# Altium schematic sheet LED点阵时钟.SchDoc
size A2
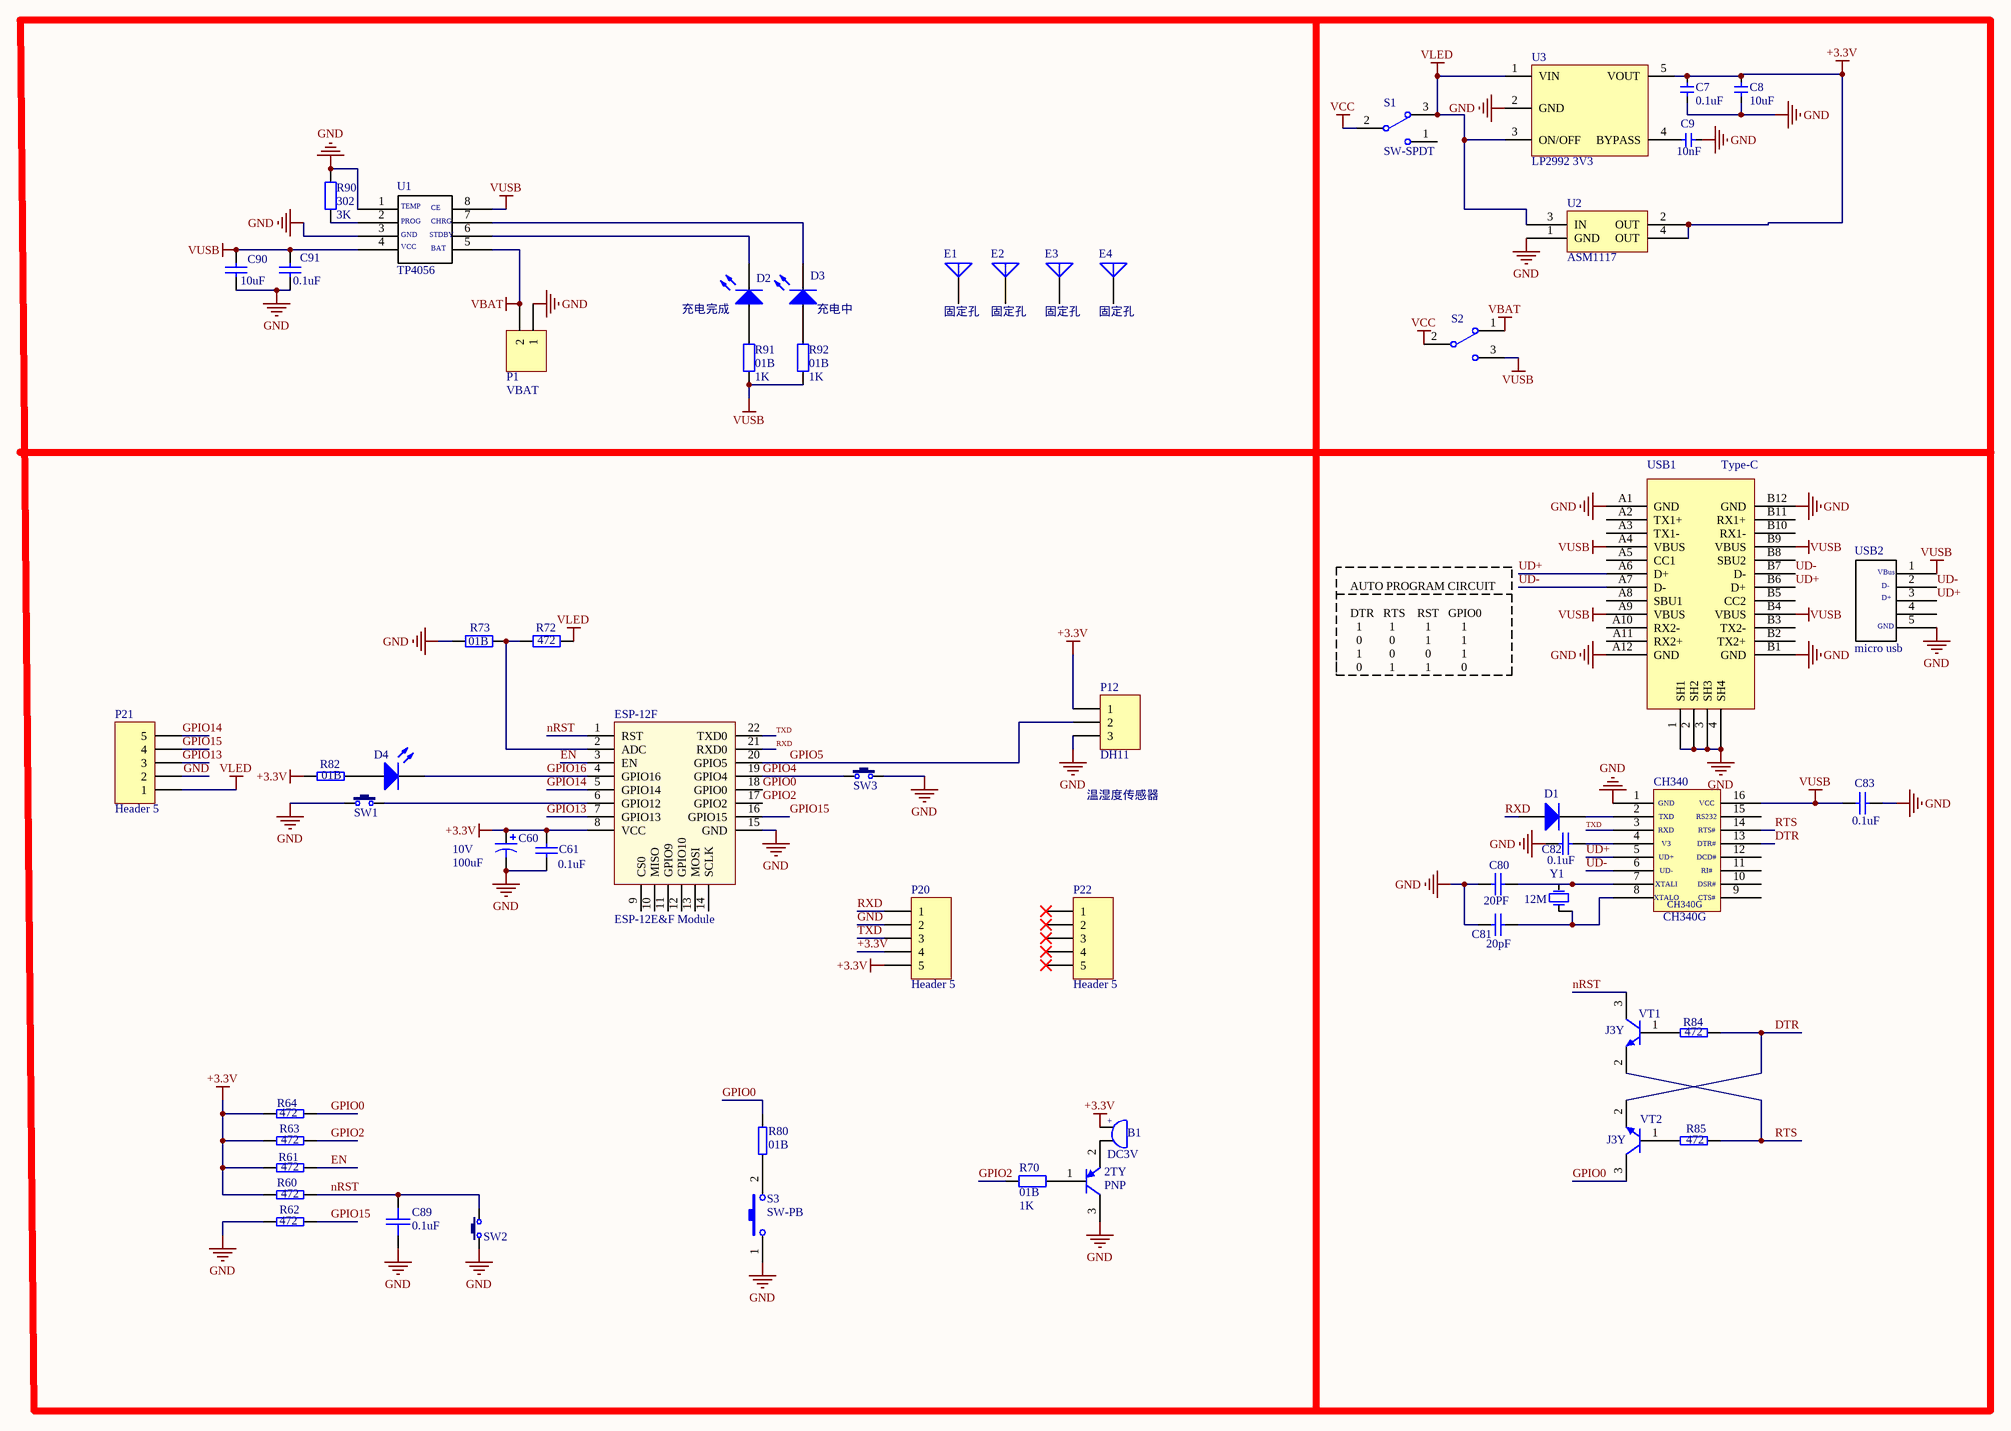
[diagram p0: LED点阵时钟.SchDoc]

## Parts
2TY  PNP  [2TY]
B1  DC3V  [BEEP 7.6x12x7.5 - X]
C7  0.1uF  [0603-1]
C8  10uF  [0603-1]
C9  10nF  [0603-1]
C60  10V  value 100uF  [CM C(5*5.4)]
C61  value 0.1uF  [0603-1]
C80  20PF  [0603-1]
C81  (no value)  [0603-1]
C82  value 0.1uF  [0603-1]
C83  value 0.1uF  [0603-1]
C89  0.1uF  [0603-1]
C90  value 10uF  [0603-1]
C91  value 0.1uF  [0603-1]
CH340  CH340G  [SOP16_M]
D1  (no value)  [T4 -Mini]
D2  (no value)  [LED 0603G]
D3  (no value)  [LED 0603R]
D4  (no value)  [LED 0603G]
E1  固定孔  [M2.2]
E2  固定孔  [M2.2]
E3  固定孔  [M2.2]
E4  固定孔  [M2.2]
ESP-12F  ESP-12E&F Module  [ESP-12E&F Module]
P1  VBAT  [XH2.54-2P_H]
P12  DH11  [HDR1X3]
P20  Header 5  [HDR1X5]
P21  Header 5  [HDR1X5]
P22  Header 5  [HDR1X5]
R60  472  [0603-1]
R61  472  [0603-1]
R62  472  [0603-1]
R63  472  [0603-1]
R64  472  [0603-1]
R70  01B  value 1K  [0603-1]
R72  472  [0603-1]
R73  01B  [0603-1]
R80  01B  [0603-1]
R82  01B  [0603-1]
R84  472  [0603-1]
R85  472  [0603-1]
R90  302  value 3K  [0603-1]
R91  01B  value 1K  [0603-1]
R92  01B  value 1K  [0603-1]
S1  SW-SPDT  [SS-12F23]
S2  (no value)  [MSK-12C01-07 - 7pin]
S3  SW-PB  [SW2 _1]
SW1  6x6x5  [TSW DIP-6*6*7_V]  (value not drawn)
SW2  6x6x5  [TSW DIP-6*6*7_V]  (value not drawn)
SW3  6x6x5  [TSW DIP-6*6*7_V]  (value not drawn)
U1  TP4056  [SOP8_N]
U2  ASM1117  [SOT-223]
U3  LP2992 3V3  [SOT23-5]
USB1  Type-C  [USB_TYPE_C_FEMALE_12_16P]
USB2  micro usb  [USB-micro_C]
VT1  J3Y  [J3Y]
VT2  J3Y  [J3Y]
Y1  value 12M  [XTAL-49S DIP]  (hidden comment: XTAL)

## Nets
+3.3V: B1.1 C7.2 C8.2 C60.1 C61.2 ESP-12F.8(VCC) P12.1 P20.4 P20.5 R60.1 R61.1 R63.1 R64.1 R82.2 U2.2(OUT) U2.4(OUT) U3.5(VOUT)
GND: 2TY.3(C) C7.1 C8.1 C9.1 C60.2 C61.1 C80.1 C81.1 C82.1 C83.2 C89.2 C90.1 C91.1 CH340.1 ESP-12F.15(GND) P1.1 P12.3 P20.2 P21.2 R62.1 R73.1 R90.1 S3.1 SW1.1 SW2.1 SW3.2 U1.1 U1.3 U2.1(GND) U3.2(GND) USB1.1(SH1) USB1.2(SH2) USB1.3(SH3) USB1.4(SH4) USB1.A1(GND) USB1.A12(GND) USB1.B1(GND) USB1.B12(GND) USB2.5
VBAT: P1.2 S2.1 U1.5
VCC: S1.2 S2.2
VLED: P21.1 R72.2 S1.3 U2.3(IN) U3.1(VIN) U3.3(ON/OFF)
VUSB: C83.1 C90.2 C91.2 CH340.16 R91.1 R92.2 S2.3 U1.4 U1.8 USB1.A4(VBUS) USB1.A9(VBUS) USB1.B4(VBUS) USB1.B9(VBUS) USB2.1
DTR: CH340.13 R84.2 VT2.2(E)
EN: ESP-12F.3(EN) R61.2
GPIO0: ESP-12F.18(GPIO0) R64.2 R80.2 VT2.3(C)
GPIO2: ESP-12F.17(GPIO2) R63.2 R70.2
GPIO4: ESP-12F.19(GPIO4) SW3.1
GPIO5: ESP-12F.20(GPIO5) P12.2
GPIO13: ESP-12F.7(GPIO13) P21.3
GPIO14: ESP-12F.5(GPIO14) P21.5
GPIO15: ESP-12F.16(GPIO15) P21.4 R62.2
GPIO16: D4.2(K) ESP-12F.4(GPIO16)
nRST: C89.1 ESP-12F.1(RST) R60.2 SW2.2 VT1.3(C)
RTS: CH340.14 R85.2 VT1.2(E)
RXD: D1.1(A) ESP-12F.21(RXD0) P20.1
TXD: CH340.3 ESP-12F.22(TXD0) P20.3
UD+: CH340.5 USB1.A6(D+) USB1.B6(D+) USB2.3
UD-: CH340.6 USB1.A7(D-) USB1.B7(D-) USB2.2
Net2TY_1: 2TY.1(B) R70.1
Net2TY_2: 2TY.2(E) B1.2
NetC9_2: C9.2 U3.4(BYPASS)
NetC80_2: C80.2 CH340.7 Y1.2(OSC2)
NetC81_2: C81.2 CH340.8 Y1.1(OSC1)
NetC82_2: C82.2 CH340.4
NetCH340_2: CH340.2 D1.2(K)
NetD2_1: D2.1(A) R91.2
NetD2_2: D2.2(K) U1.6
NetD3_1: D3.1(A) R92.1
NetD3_2: D3.2(K) U1.7
NetD4_1: D4.1(A) R82.1
NetESP-12F_2: ESP-12F.2(ADC) R72.1 R73.2
NetESP-12F_6: ESP-12F.6(GPIO12) SW1.2
NetR80_1: R80.1 S3.2
NetR84_1: R84.1 VT1.1(B)
NetR85_1: R85.1 VT2.1(B)
NetR90_2: R90.2 U1.2

Not connected (* = marked no-connect by the designer): CH340 9 10 11 12 15; E1 1(A); E2 1(A); E3 1(A); E4 1(A); ESP-12F 9(CS0) 10(MISO) 11(GPIO9) 12(GPIO10) 13(MOSI) 14(SCLK); P22 1* 2* 3* 4* 5*; S1 1; USB1 A2(TX1+) A3(TX1-) A5(CC1) A8(SBU1) A10(RX2-) A11(RX2+) B2(TX2+) B3(TX2-) B5(CC2) B8(SBU2) B10(RX1-) B11(RX1+); USB2 4

## Notes on the sheet
- 充电完成
- (near D3) 充电中
- AUTO PROGRAM CIRCUIT
  DTR   RTS    RST   GPIO0
  1         1          1          1
  0         0          1          1
  1         0          0          1
  0         1          1          0
- 温湿度传感器
- (in symbol BEEP) +
- (in symbol CH340G) GND; VCC; TXD; RS232; RXD; RTS#; V3; DTR#; UD+; DCD#; UD-; RI#; XTALI; DSR#; XTALO; CTS#
- (in symbol micro usb) VBus; D-; D+; GND
- (in symbol TP4056) TEMP; CE; PROG; CHRG; GND; STDBY; VCC; BAT

## Library data of the parts
2TY = PNP: PNP Bipolar Transistor; Published: 8-Jun-2000; LatestRevisionDate: 29-May-2009; LatestRevisionNote: IPC-7351 Footprint Added.; PackageVersion: Aug-1999; PackageReference: SOT-23B; Publisher: Altium Limited; PackageDescription: 3-Pin SOT-23 Package 0.95 mm Pitch, 2.4 mm Lead Span
B1 = BEEP: 蜂鸣器; 版权归属: 源创客; BOM名称: 蜂鸣器; 学习资源: www.ooocke.com
C7 C9 = 电容-0402: Capacitor; Value: 0.1u
C8 = 电容-0603: Capacitor; Value: 0.1u
C60 = Cap Pol3: Polarized Capacitor (Surface Mount); Published: 8-Jun-2000; LatestRevisionDate: 29-May-2009; LatestRevisionNote: IPC-7351 Footprint Added.; PackageReference: C0805; Publisher: Altium Limited; PackageDescription: Chip Capacitor
C61 C82 C83 C90 C91 = Cap: Capacitor; Published: 8-Jun-2000; LatestRevisionDate: 17-Jul-2002; LatestRevisionNote: Re-released for DXP Platform.; PackageReference: RAD-0.3; Publisher: Altium Limited; PackageDescription: Radial Cap, Thru-Hole; 2 Leads; 0.3 in Pin Spacing
C80 C81 = Cap: Published: 8-Jun-2000; LatestRevisionDate: 17-Jul-2002; LatestRevisionNote: Re-released for DXP Platform.; PackageReference: RAD-0.3; Publisher: Altium Limited; PackageDescription: Radial Cap, Thru-Hole; 2 Leads; 0.3 in Pin Spacing
  C80: Value: 20pF
C89 = SMT_C_0402: Surface mount capacitor 0402
D1 = Diode 1N4003: 1 Amp General Purpose Rectifier; Published: 8-Jun-2000; LatestRevisionDate: 17-Jul-2002; LatestRevisionNote: Re-released for DXP Platform.; DatasheetVersion: 1998; PackageVersion: Aug-1999; PackageReference: DO-41; Publisher: Altium Limited; PackageDescription: Diode, Axial; Body 5.2 x 2.7 mm (LxDia. max), Lead Dia. 0.86 mm (max); Code_JEDEC: DO-204-AL; ComponentLink1Description: Manufacturer Link; ComponentLink1URL: http://www.fairchildsemi.com/; ComponentLink2Description: Datasheet; ComponentLink2URL: http://www.fairchildsemi.com/ds/1N%2F1N4001.pdf
D2-D4 = LED0: Typical INFRARED GaAs LED; Published: 8-Jun-2000; LatestRevisionDate: 08-Jul-2005; LatestRevisionNote: Mech Layer 1 removed.; PackageReference: LED-0; Publisher: Altium Limited; PackageDescription: LED; 2 Leads
E1-E4 = Antenna: Generic Antenna; Published: 24-Mar-1999; LatestRevisionDate: 17-Jul-2002; LatestRevisionNote: Re-released for DXP Platform.; PackageReference: PIN1; Publisher: Altium Limited
P1 = Header 2: Header, 2-Pin; LatestRevisionDate: 17-Jul-2002; LatestRevisionNote: Re-released for DXP Platform.; Publisher: Altium Limited
P12 = Header 3: Header, 3-Pin; LatestRevisionDate: 17-Jul-2002; LatestRevisionNote: Re-released for DXP Platform.; Publisher: Altium Limited
P20-P22 = Header 5: Header, 5-Pin; LatestRevisionDate: 17-Jul-2002; LatestRevisionNote: Re-released for DXP Platform.; Publisher: Altium Limited
R60-R64 R80 R82 R84 R85 = SMT_R_0402: Surface mount resistor 0402
R70 R72 R73 R90-R92 = Res2: Resistor; Published: 8-Jun-2000; LatestRevisionDate: 17-Jul-2002; LatestRevisionNote: Re-released for DXP Platform.; PackageReference: AXIAL-0.4; Publisher: Altium Limited; PackageDescription: Axial Device, Thru-Hole; 2 Leads; 0.4 in Pin Spacing
S1 = SW-SPDT: SPDT Subminiature Toggle Switch, Right Angle Mounting, Vertical Actuation; Published: 24-Mar-1999; LatestRevisionDate: 17-Dec-2003; LatestRevisionNote: Schematic revised, PCB Footprint replaced.; DatasheetVersion: 05-Dec-2000; PackageReference: TL36WW15050; Publisher: Altium Limited; PackageDescription: Switch; 4 Leads; ComponentLink1Description: Manufacturer Link; ComponentLink1URL: http://www.apem.com
S2 = SSW-1P: 1路波动开关; BOM名称: 波动开关; 版权归属: 源创客; 学习资源: www.ooocke.com
S3 = SW-PB: 微动开关; Published: 24-Mar-1999; LatestRevisionDate: 17-Jul-2002; LatestRevisionNote: Re-released for DXP Platform.; PackageReference: SPST-2; Publisher: Altium Limited
SW1-SW3 = TSW DIP-6x6_V: 侧按直插6x6轻触开关; 版权归属: 源创客; BOM名称: 直插6x6轻触开关; 学习资源: www.ooocke.com
U2 = ASM1117: 3.3V稳压芯片
U3 = LP2992: LDO
USB1 = USB-Type-C-TOP
VT1 VT2 = SMT_TRIODE_NPN: Surface mount NPN transistor, package SOT-23
Y1 = XTAL: 晶振; Published: 8-Jun-2000; LatestRevisionDate: 17-Jul-2002; LatestRevisionNote: Re-released for DXP Platform.; PackageReference: R38; Publisher: Altium Limited